# Altium project USER_SW_Breakout.PrjPCB
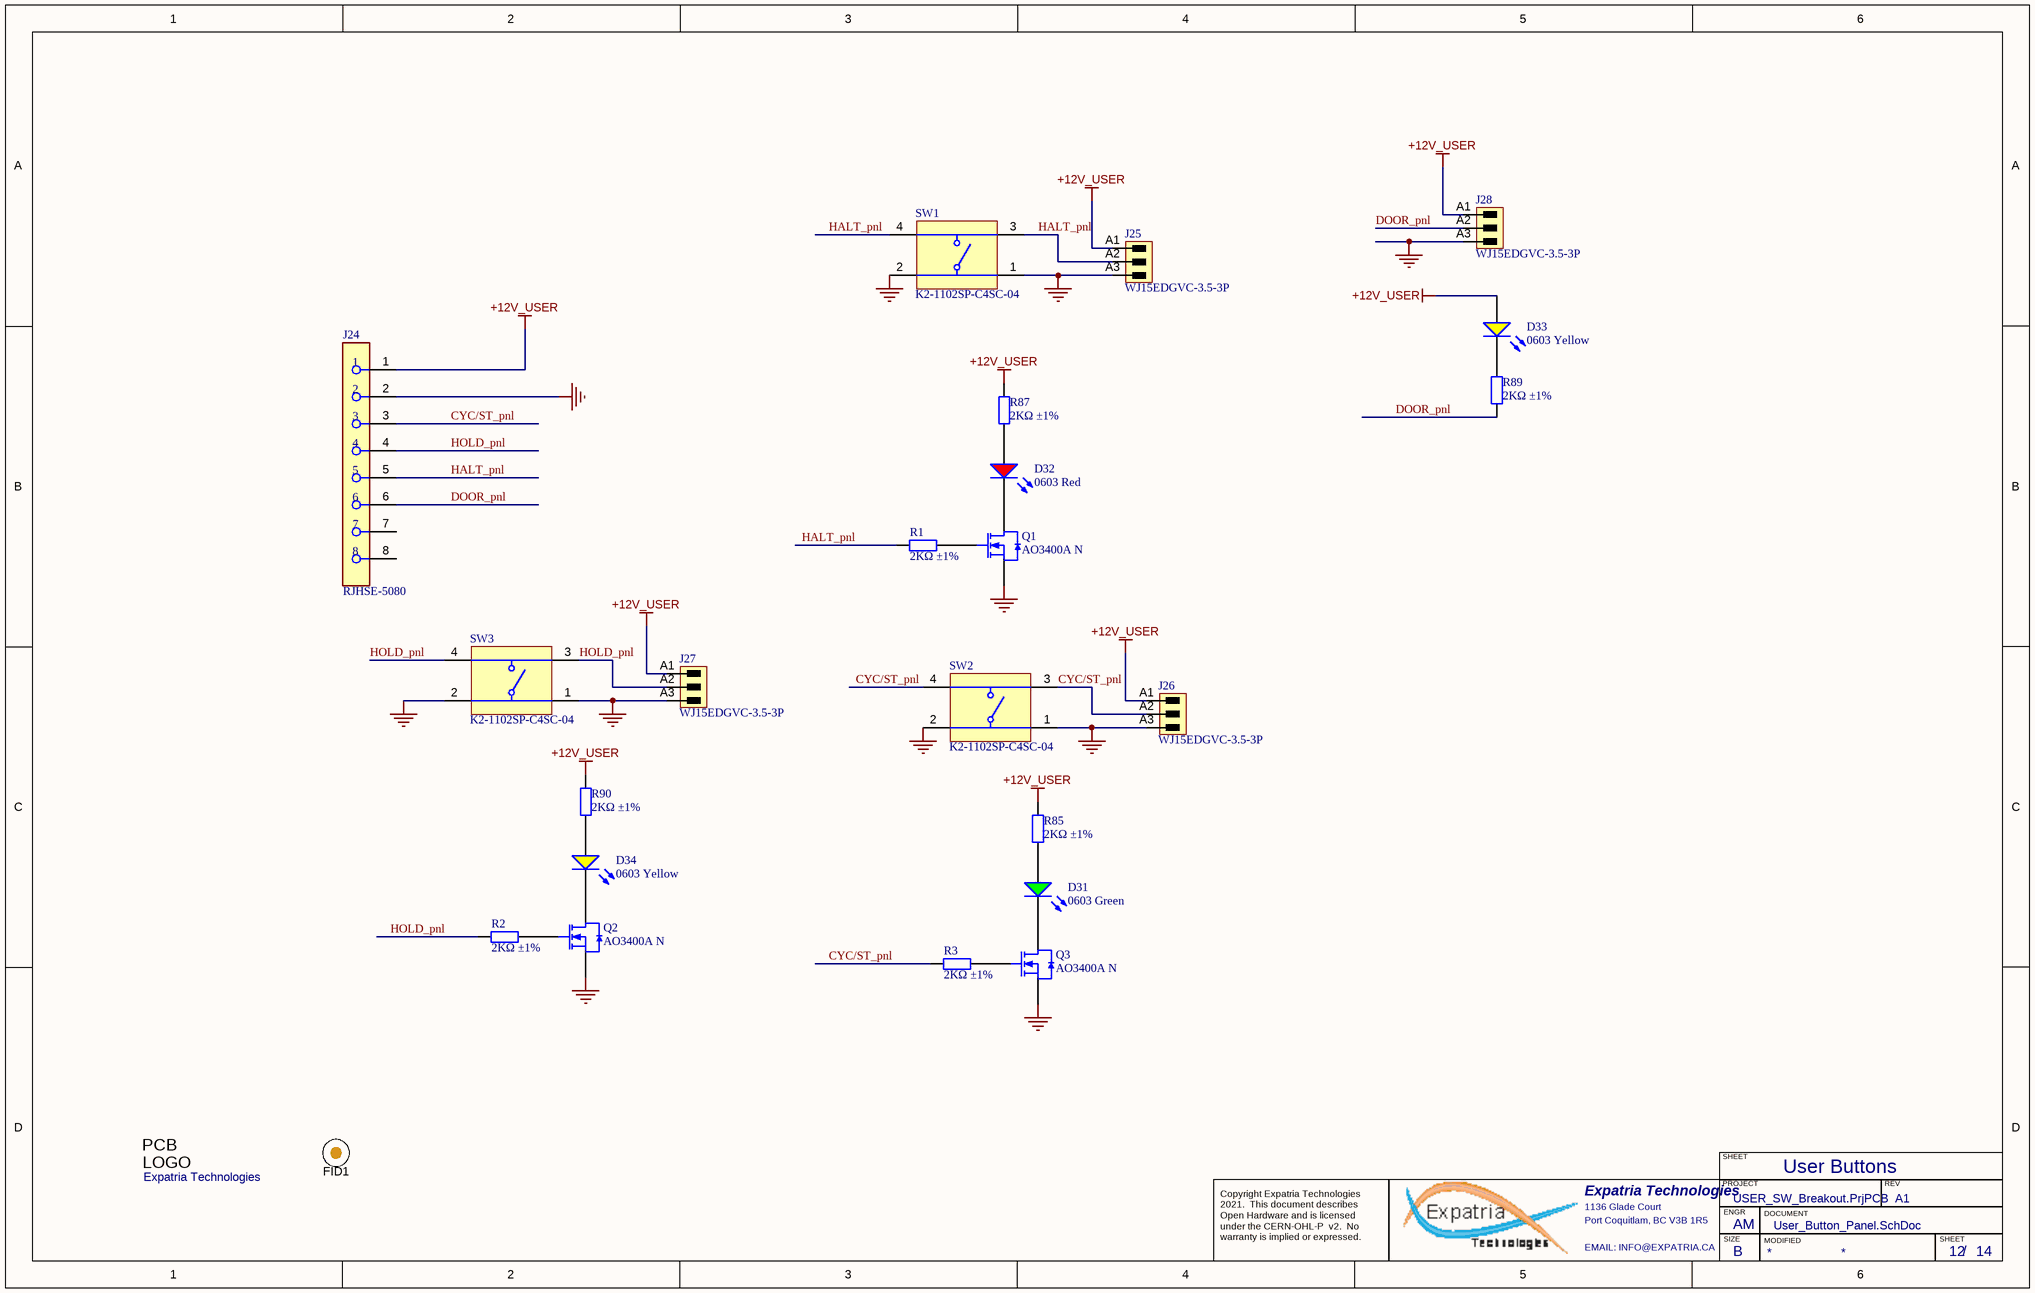
[diagram p0: User_Button_Panel.SchDoc]
PCBPARTNO: GRBLHAL_2000_EST; PCBREVNO: A7; Title: GRBLHAL_2000_EST; VarRevNo: A7
1 sheet, 24 parts. Net scope: hierarchical (ports join the sheet entries above them; power ports are global).
Board file: USER_SW_Breakout.pcbdoc

## Sheet User_Button_Panel.SchDoc: GRBLHAL_2000_EST
size B; Author: AM; CompanyName: Expatria Technologies; DrawnBy: A.Marles; Engineer: AM; Organization: Expatria Technologies; DocumentNumber: 12; Revision: A1; SheetNumber: 12; SheetTotal: 14; PCB_Rev: A1

### Parts
D31  0603 Green  [0603_LED_S1]
D32  0603 Red  [0603_LED_S1]
D33  0603 Yellow  [0603_LED_S1]
D34  0603 Yellow  [0603_LED_S1]
FID1  Fiducial  [Fiducial10-20]  (value not drawn)  (no BOM)
J24  RJHSE-5080  [FP-RJHSE-5080-MFG]
J25  WJ15EDGVC-3.5-3P  [SL_3_50_180G_03]  (no BOM)
J26  WJ15EDGVC-3.5-3P  [SL_3_50_180G_03]  (no BOM)
J27  WJ15EDGVC-3.5-3P  [SL_3_50_180G_03]  (no BOM)
J28  WJ15EDGVC-3.5-3P  [SL_3_50_180G_03]  (no BOM)
Logo1  Expatria Technologies  [Expatria-Logo]  (no BOM)
Q1  AO3400A N  [SOT-23-3L]
Q2  AO3400A N  [SOT-23-3L]
Q3  AO3400A N  [SOT-23-3L]
R1  2KΩ ±1%  [0603_R]
R2  2KΩ ±1%  [0603_R]
R3  2KΩ ±1%  [0603_R]
R85  2KΩ ±1%  [0603_R]
R87  2KΩ ±1%  [0603_R]
R89  2KΩ ±1%  [0603_R]
R90  2KΩ ±1%  [0603_R]
SW1  K2-1102SP-C4SC-04  [TECO-FSM4JSMATR_V]
SW2  K2-1102SP-C4SC-04  [TECO-FSM4JSMATR_V]
SW3  K2-1102SP-C4SC-04  [TECO-FSM4JSMATR_V]

### Nets
+12V_USER: D33.A J24.1 J25.A1 J26.A1 J27.A1 J28.A1 R85.2 R87.1 R90.1
GND_USER: J24.2 J25.A3 J26.A3 J27.A3 J28.A3 Q1.2(S) Q2.2(S) Q3.2(S) SW1.1 SW1.2 SW2.1 SW2.2 SW3.1 SW3.2
CYC/ST_pnl: J24.3 J26.A2 R3.2 SW2.3 SW2.4
DOOR_pnl: J24.6 J28.A2 R89.2
HALT_pnl: J24.5 J25.A2 R1.2 SW1.3 SW1.4
HOLD_pnl: J24.4 J27.A2 R2.2 SW3.3 SW3.4
NetD31_A: D31.A R85.1
NetD31_K: D31.K Q3.3(D)
NetD32_A: D32.A R87.2
NetD32_K: D32.K Q1.3(D)
NetD33_K: D33.K R89.1
NetD34_A: D34.A R90.2
NetD34_K: D34.K Q2.3(D)
NetQ1_1: Q1.1(G) R1.1
NetQ2_1: Q2.1(G) R2.1
NetQ3_1: Q3.1(G) R3.1

Not connected (* = marked no-connect by the designer): J24 7 8

### Notes on the sheet
- User Buttons
- SHEET
- Expatria Technologies
- 1136 Glade Court
- Port Coquitlam, BC V3B 1R5
- PROJECT
- SIZE
- ENGR
- MODIFIED
- DOCUMENT
- REV
- Copyright Expatria Technologies 2021.  This document describes Open Hardware and is licensed under the CERN-OHL-P  v2.  No warranty is implied or expressed.
- EMAIL: INFO@EXPATRIA.CA
- B
- /
- (in symbol SBT-Logo) PCB; LOGO

### Library data of the parts
D31 = 0603 LED Green: LED; Package: 0603; Supplier: LC; SuppliersPartNumber: C72043; Color: Green
D32 = 0603 LED Red: LED; Package: 0603; Supplier: LC; SuppliersPartNumber: C2286; Color: Red
D33 D34 = 0603 LED Yellow: LED; Package: 0603; Supplier: LC; SuppliersPartNumber: C72038; Color: Yellow
FID1 = Fiducial: FIDUCIAL NO ASSEMBLY; Manufacturer 1: NONE; Manufacturer Part Number 1: NONE; Value: Fiducial
J24 = CMP-02366-000003-1: CONN MOD JACK 8P8C R/A UNSHLD; Manufacturer Part Number: E5J88-00LJG2-L; Manufacturer: Pulse Electronics Network; Pitch: 1.02mm; ComponentLink2URL: https://cdn.amphenol-icc.com/media/wysiwyg/files/documentation/datasheet/inputoutput/io-modjack-rjhse.pdf; Device Class L1: Connectors; Package: CONN_MOD_JACK; Digikey Description: CONN MOD JACK 8P8C R/A UNSHLD; ComponentLink2Description: Datasheet; SuppliersPartNumber: C385834
J25-J28 = CMP-1559-00904-1: Header,Male Pin,Covered(4 Sided) 3 1 0.138"（3.50mm） 3 P=3.5mm Pluggable System Terminal Block RoHS; Manufacturer: Ningbo Kangnex Elec; Pitch_mm: 3.5 mm; UL_94_flammability_rating: V-0; Side_termination_characteristic: closed side; Solder_pin_length_mm: 3.2 mm; Short_text_for_material: SL 3.50/03/180G 3.2SN OR BX; Pitch_inch: 0.138 inch; PartNumber: WJ15EDGVC-3.5-3P; PackageReference: SL_3_50_180G_03; Packaging: Box; Revision: V1; SuppliersPartNumber: C192778
Logo1 = SBT-Logo: Manufacturer 1: NONE; Value: Expatria Logo; Manufacturer Part Number 1: NONE
Q1-Q3 = AO3400A N道沟 X0YV1T SOT-23: MOS(场效应管); ComponentLink1Description: 供应商链接; ComponentLink1URL: http://www.szlcsc.com/product/details_21629.html; Package: SOT-23; Supplier: LC; SuppliersPartNumber: C700953
R1-R3 R85 R87 R89 R90 = 0603 2K (2001) 1%: Chip resistor; Manufacturer: Uniroyal Elec; PartNumber: 0603WAF2001T5E; Power: 1/10W; Package: 0603; Supplier: LC; SuppliersPartNumber: C22975; Resistance: 2KΩ; Tolerance: 1%; ComponentLink1Description: Supplier link; ComponentLink1URL: http://www.szlcsc.com/product/details_23702.html
SW1-SW3 = CMP-2000-07486-1: Top Actuated 50mA @ 12VDC Round Button SPST 6*6mm Tactile Switches ROHS; SuppliersPartNumber: C127509; Package: SMD-4_6.0x6.0x4.5P

## Assembly variants
SMT_ONLY: not fitted A1 J1 J2 J3 J4 J5 J6 J7 J8 J9 J10 J11 J12 J13 J14 J15 J16 J17 J18 J19 J20 J21 J22 J22 J23 J23 J24 J25 J26 J27 J28 L3 P1 P2 P3 P4 P5 P6 P7 P8 P9 P10 P11 P12 P12 P13 P13 P14 P14 P15 P15 P16 P16 P16 P17 P17 P18 P18 P19 P19 R76 U15 VR2
FULL_ASSEMBLY: not fitted J? J? J? J? R76 U15